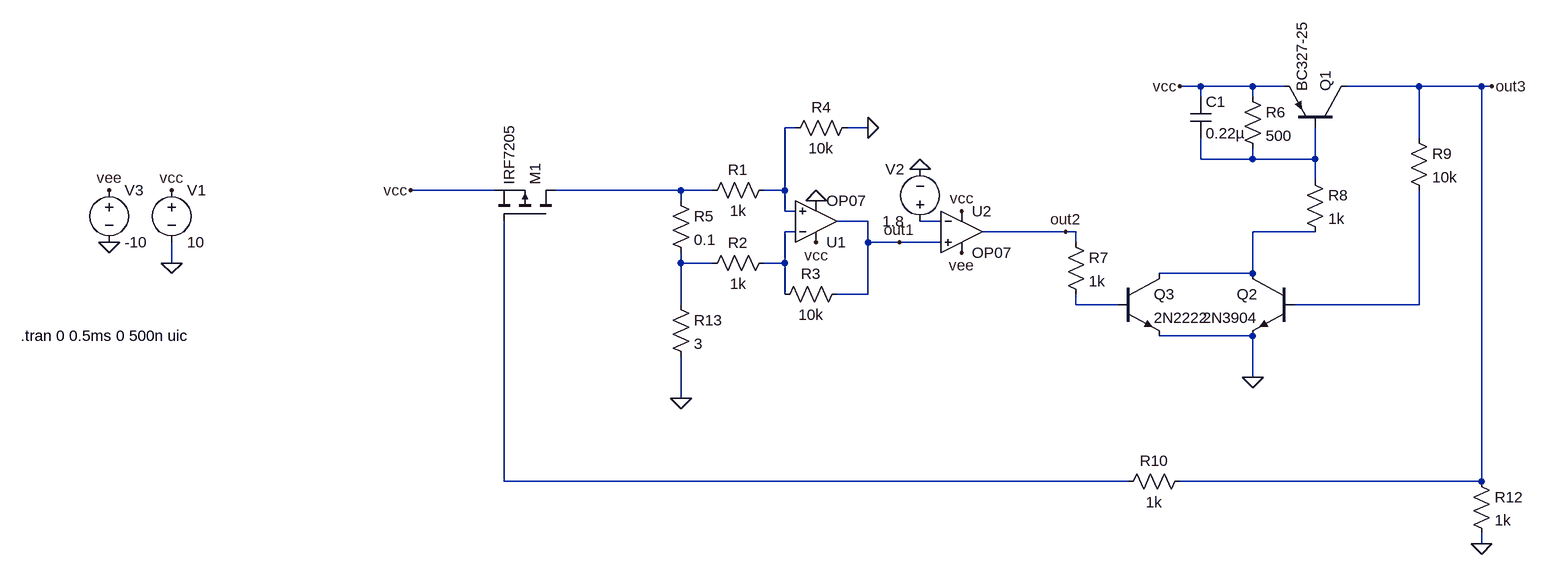
[diagram p0: schematic Positive_rail_current_limit_with_latch.asc]
Positive_rail_current_limit_with_latch.asc, the LTspice schematic file:
Version 4
SHEET 1 1232 680
WIRE 704 -48 672 -48
WIRE 784 -48 704 -48
WIRE 832 -48 784 -48
WIRE 1040 -48 928 -48
WIRE 1136 -48 1040 -48
WIRE 1152 -48 1136 -48
WIRE 704 -32 704 -48
WIRE 784 -32 784 -48
WIRE 80 16 64 16
WIRE 192 16 160 16
WIRE 1040 32 1040 -48
WIRE 704 64 704 32
WIRE 784 64 784 48
WIRE 784 64 704 64
WIRE 880 64 880 16
WIRE 880 64 784 64
WIRE 880 96 880 64
WIRE -384 112 -512 112
WIRE -96 112 -288 112
WIRE -48 112 -96 112
WIRE 64 112 64 16
WIRE 64 112 32 112
WIRE -96 128 -96 112
WIRE 64 144 64 112
WIRE 80 144 64 144
WIRE 192 160 144 160
WIRE 304 160 272 160
WIRE 80 176 64 176
WIRE 496 176 368 176
WIRE 512 176 496 176
WIRE 880 176 784 176
WIRE 192 192 192 160
WIRE 240 192 192 192
WIRE 304 192 240 192
WIRE 512 192 512 176
WIRE -880 224 -880 192
WIRE -96 224 -96 208
WIRE -48 224 -96 224
WIRE 64 224 64 176
WIRE 64 224 32 224
WIRE 784 240 784 176
WIRE 784 240 640 240
WIRE 64 272 64 224
WIRE 192 272 192 192
WIRE 192 272 144 272
WIRE -96 288 -96 224
WIRE 512 288 512 272
WIRE 576 288 512 288
WIRE 1040 288 1040 112
WIRE 1040 288 848 288
WIRE 784 336 640 336
WIRE 784 400 784 336
WIRE -96 432 -96 368
WIRE -368 560 -368 160
WIRE 592 560 -368 560
WIRE 1136 560 1136 -48
WIRE 1136 560 672 560
WIRE 1136 656 1136 640
FLAG -880 224 0
FLAG -880 112 vcc
FLAG 112 192 vcc
FLAG 112 128 0
FLAG -512 112 vcc
FLAG -96 432 0
FLAG 336 144 vcc
FLAG 272 80 0
FLAG 192 16 0
FLAG -976 112 vee
FLAG -976 192 0
FLAG 240 192 out1
FLAG 496 176 out2
FLAG 784 400 0
FLAG 1152 -48 out3
FLAG 672 -48 vcc
FLAG 1136 656 0
FLAG 336 208 vee
SYMBOL res 48 208 R90
WINDOW 0 0 56 VBottom 2
WINDOW 3 32 56 VTop 2
SYMATTR InstName R2
SYMATTR Value 1k
SYMBOL res 48 96 R90
WINDOW 0 0 56 VBottom 2
WINDOW 3 32 56 VTop 2
SYMATTR InstName R1
SYMATTR Value 1k
SYMBOL res 160 256 R90
WINDOW 0 0 56 VBottom 2
WINDOW 3 32 56 VTop 2
SYMATTR InstName R3
SYMATTR Value 10k
SYMBOL res 176 0 R90
WINDOW 0 0 56 VBottom 2
WINDOW 3 32 56 VTop 2
SYMATTR InstName R4
SYMATTR Value 10k
SYMBOL voltage -880 96 R0
WINDOW 123 0 0 Left 0
WINDOW 39 0 0 Left 0
SYMATTR InstName V1
SYMATTR Value 10
SYMBOL res -112 112 R0
SYMATTR InstName R5
SYMATTR Value 0.1
SYMBOL voltage 272 176 R180
WINDOW 0 24 96 Left 2
WINDOW 3 24 16 Left 2
WINDOW 123 0 0 Left 0
WINDOW 39 0 0 Left 0
SYMATTR InstName V2
SYMATTR Value 1.8
SYMBOL voltage -976 96 R0
WINDOW 123 0 0 Left 0
WINDOW 39 0 0 Left 0
SYMATTR InstName V3
SYMATTR Value -10
SYMBOL pnp 928 16 M270
SYMATTR InstName Q1
SYMATTR Value BC327-25
SYMBOL res 864 80 R0
SYMATTR InstName R8
SYMATTR Value 1k
SYMBOL res 1024 16 R0
SYMATTR InstName R9
SYMATTR Value 10k
SYMBOL npn 848 240 M0
SYMATTR InstName Q2
SYMATTR Value 2N3904
SYMBOL npn 576 240 R0
SYMATTR InstName Q3
SYMATTR Value 2N2222
SYMBOL res 496 176 R0
SYMATTR InstName R7
SYMATTR Value 1k
SYMBOL res 768 -48 R0
SYMATTR InstName R6
SYMATTR Value 500
SYMBOL cap 688 -32 R0
SYMATTR InstName C1
SYMATTR Value 0.22µ
SYMBOL res 688 544 R90
WINDOW 0 0 56 VBottom 2
WINDOW 3 32 56 VTop 2
SYMATTR InstName R10
SYMATTR Value 1k
SYMBOL res 1120 544 R0
SYMATTR InstName R12
SYMATTR Value 1k
SYMBOL res -112 272 R0
SYMATTR InstName R13
SYMATTR Value 3
SYMBOL OpAmps\\OP07 112 224 M180
SYMATTR InstName U1
SYMBOL OpAmps\\OP07 336 112 R0
SYMATTR InstName U2
SYMBOL pmos -288 160 M270
SYMATTR InstName M1
SYMATTR Value IRF7205
TEXT -1112 336 Left 2 !.tran 0 0.5ms 0 500n uic

The netlist it stands for:
* Positive_rail_current_limit_with_latch.asc
R2 N005 N007 1k
R1 N001 N003 1k
R3 out1 N005 10k
R4 0 N001 10k
V1 vcc 0 10
R5 N003 N007 0.1
V2 N004 0 1.8
V3 vee 0 -10
Q1 out3 N002 vcc 0 BC327-25
R8 N002 N006 1k
R9 out3 N009 10k
Q2 N006 N009 0 0 2N3904
Q3 N006 N008 0 0 2N2222
R7 out2 N008 1k
R6 vcc N002 500
C1 vcc N002 0.22µ
R10 out3 N010 1k
R12 out3 0 1k
R13 N007 0 3
XU1 N001 N005 vcc 0 out1 LT1001  ; OP07, pins In+ In- V+ V- OUT
XU2 out1 N004 vcc vee out2 LT1001  ; OP07, pins In+ In- V+ V- OUT
M1 N003 N010 vcc vcc IRF7205
.model NPN NPN
.model PNP PNP
.lib standard.bjt
.model NMOS NMOS
.model PMOS PMOS
.lib standard.mos
.tran 0 0.5ms 0 500n uic
.lib LTC.lib
.backanno
.end